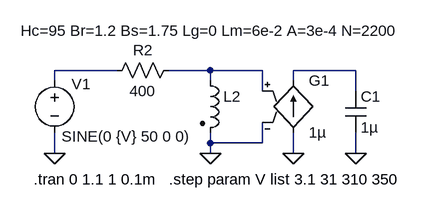
[diagram p0: schematic NL_Loop.asc]
NL_Loop.asc, the LTspice schematic file:
Version 4
SHEET 1 1000 680
WIRE 240 80 144 80
WIRE 384 80 320 80
WIRE 464 80 384 80
WIRE 608 80 512 80
WIRE 144 96 144 80
WIRE 384 96 384 80
WIRE 512 96 512 80
WIRE 464 112 464 80
WIRE 608 112 608 80
WIRE 384 192 384 176
WIRE 464 192 464 160
WIRE 464 192 384 192
WIRE 144 208 144 176
WIRE 384 208 384 192
WIRE 512 208 512 176
WIRE 608 208 608 176
FLAG 144 208 0
FLAG 384 208 0
FLAG 512 208 0
FLAG 608 208 0
SYMBOL voltage 144 80 R0
WINDOW 3 11 102 Left 0
WINDOW 123 0 0 Left 0
WINDOW 39 0 0 Left 0
WINDOW 0 26 21 Left 0
SYMATTR Value SINE(0 {V} 50 0 0)
SYMATTR InstName V1
SYMBOL ind2 368 80 R0
WINDOW 3 -276 -61 Left 0
SYMATTR Value Hc=95 Br=1.2 Bs=1.75 Lg=0 Lm=6e-2 A=3e-4 N=2200
SYMATTR InstName L2
SYMATTR Type ind
SYMBOL res 336 64 R90
WINDOW 0 0 56 VBottom 0
WINDOW 3 32 56 VTop 0
SYMATTR InstName R2
SYMATTR Value 400
SYMBOL g 512 80 R0
SYMATTR InstName G1
SYMATTR Value 1µ
SYMBOL cap 592 112 R0
SYMATTR InstName C1
SYMATTR Value 1µ
TEXT 112 248 Left 0 !.tran 0 1.1 1 0.1m
TEXT 320 248 Left 0 !.step param V list 3.1 31 310 350

The netlist it stands for:
* NL_Loop.asc
V1 N001 0 SINE(0 {V} 50 0 0)
L2 N002 0 Hc=95 Br=1.2 Bs=1.75 Lg=0 Lm=6e-2 A=3e-4 N=2200
R2 N002 N001 400
G1 0 N003 N002 0 1µ
C1 N003 0 1µ
.tran 0 1.1 1 0.1m
.step param V list 3.1 31 310 350
.backanno
.end